# Altium project Motor_ctrl.PrjPcb
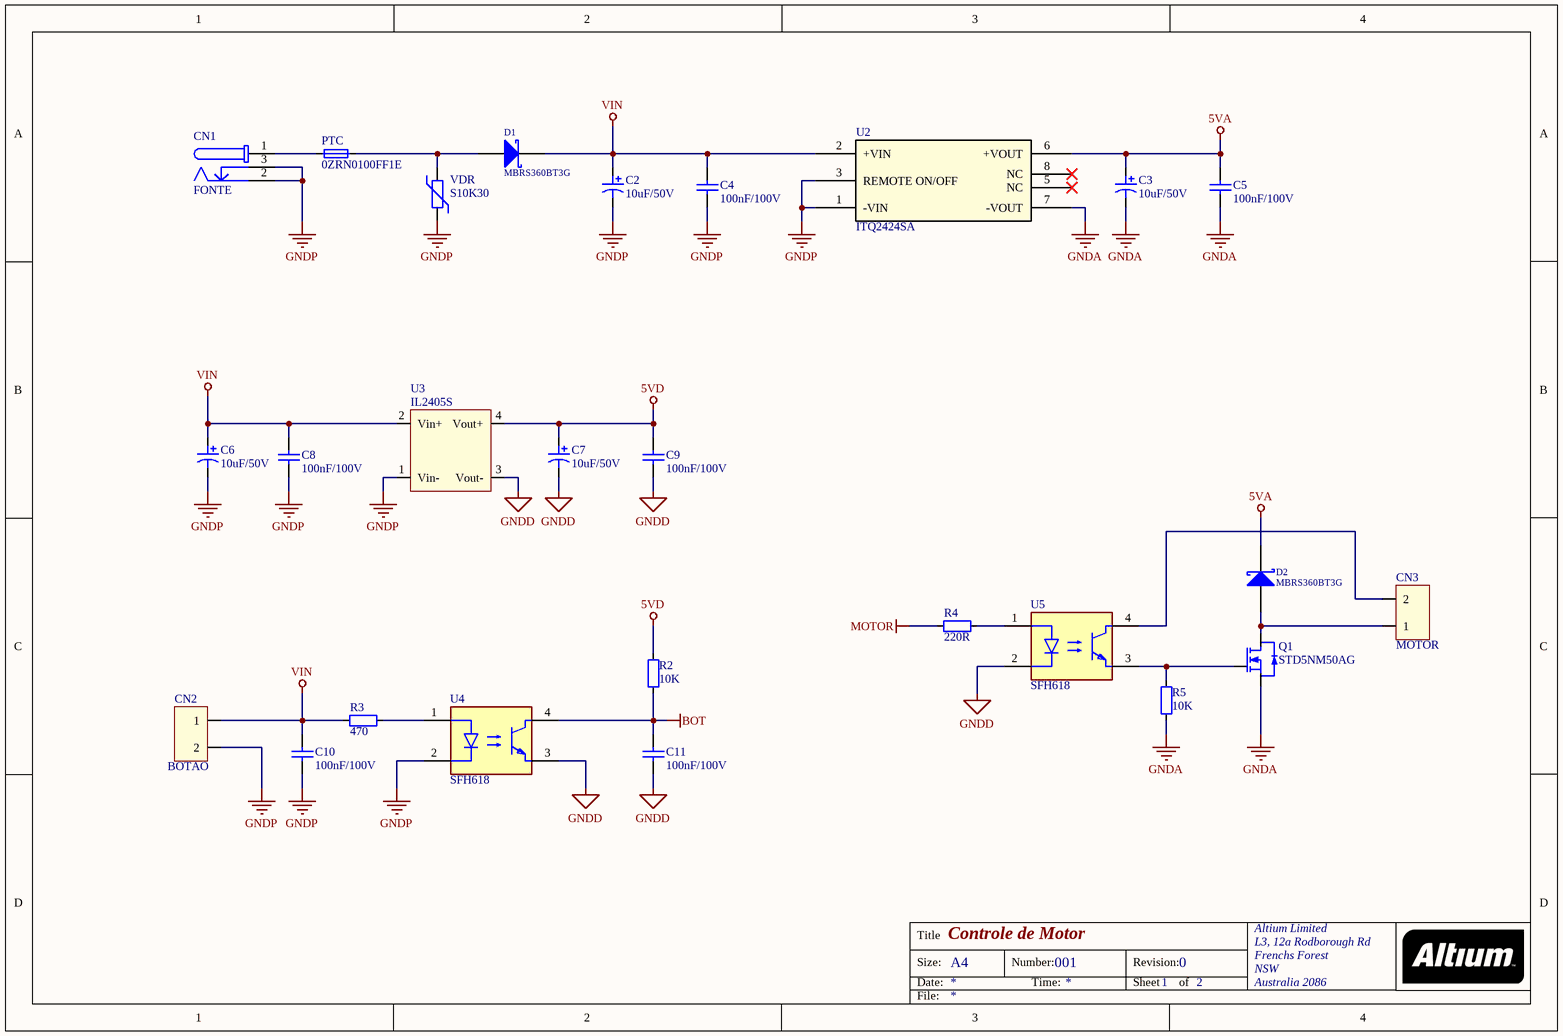
[diagram p0: Sheet1.SchDoc]
2 sheets, 42 parts. Net scope: global (net labels, ports and power ports of the same name join across sheets).
Board file: PCB1.PcbDoc
Sheets:
  Sheet1.SchDoc
  Sheet2.SchDoc

## Sheet Sheet1.SchDoc: Controle de Motor
size A4; Organization: Altium Limited; Address1: L3, 12a Rodborough Rd; Address2: Frenchs Forest; Address3: NSW; Address4: Australia 2086; DocumentNumber: 001; Revision: 0; SheetNumber: 1; SheetTotal: 2

### Parts
C2  10uF/50V  [CapE SMD D6.3 L5.8]
C3  10uF/50V  [CapE SMD D6.3 L5.8]
C4  100nF/100V  [0603C-GENERIC]
C5  100nF/100V  [0603C-GENERIC]
C6  10uF/50V  [CapE SMD D6.3 L5.8]
C7  10uF/50V  [CapE SMD D6.3 L5.8]
C8  100nF/100V  [0603C-GENERIC]
C9  100nF/100V  [0603C-GENERIC]
C10  100nF/100V  [0603C-GENERIC]
C11  100nF/100V  [0603C-GENERIC]
CN1  FONTE  [Power Jack 694106301002]
CN2  BORNE  [AKZ700/2]  (value not drawn)
CN3  BORNE  [AKZ700/2]  (value not drawn)
D1  MBRS360BT3G  [DO-214AA(SMB)]
D2  MBRS360BT3G  [DO-214AA(SMB)]
PTC  0ZRN0100FF1E  [PTC LVR]
Q1  STD5NM50AG  [DPAK-3_ONS]
R2  10K  [0603R]
R3  470  [Res 1206]
R4  220R  [0603R]
R5  10K  [0603R]
U2  ITQ2424SA  [SIP8_ITQ2424_XPR]
U3  IL2405S  [IL SERIES]
U4  SFH618  [FP-83911-MFG]
U5  SFH618  [FP-83911-MFG]
VDR  S10K30  [VDR D12H14.5-7.5]

### Nets
5VA: C3.1(+) C5.2 D2.2(K) U2.6(+VOUT)
5VD: C7.1(+) C9.2 R2.1 U3.4(Vout+)
BOT: C11.2 R2.2 U4.4(C)
GNDA: C3.2(-) C5.1 Q1.2(S) R5.2 U2.7(-VOUT)
GNDD: C7.2(-) C9.1 C11.1 U3.3(Vout-) U4.3(E) U5.2(C)
GNDP: C2.2(-) C4.1 C6.2(-) C8.1 C10.1 CN1.2 CN1.3 CN2.2 U2.1(-VIN) U2.3(REMOTE_ON/OFF) U3.1(Vin-) U4.2(C) VDR.1
MOTOR: R4.1
VIN: C2.1(+) C4.2 C6.1(+) C8.2 C10.2 CN2.1 D1.2(K) R3.2 U2.2(+VIN) U3.2(Vin+)
NetCN1_1: CN1.1 PTC.1
NetCN3_1: CN3.1 D2.1(A) Q1.3(D)
NetCN3_2: CN3.2 U5.4(C)
NetD1_1: D1.1(A) PTC.2 VDR.2
NetQ1_1: Q1.1(G) R5.1 U5.3(E)
NetR3_1: R3.1 U4.1(A)
NetR4_2: R4.2 U5.1(A)

Not connected (* = marked no-connect by the designer): U2 5(NC)* 8(NC)*

### Notes on the sheet
- (near CN3) MOTOR
- (near CN2) BOTAO
- Title
- Size:
- Date:
- A4
- Number:
- Time:
- Revision:
- Sheet
- of
- File:

### Library data of the parts
C2 C3 C6 C7 = Cap Eletrolitico: Capacitor Eletrolítico Radial SMD; Protheus: E3CS3010U0003
C4 C5 C8-C11 = Cap Ceramico SMD: Capacitor Cerâmico SMD; Protheus: E3CSC100N0002
CN1 = DC Power Jack: Part Number: 694106301002; NexarPartId: 52676100; Voltage Rating: 24V; Insulation Resistance: 100MΩ; Current Rating: 5A; Shielding: Unshielded; Number of Contacts: 3; Mouser: 710-694106301002; Housing Material: Polyamide; Contact Gender: Female; Connector Type: Power; REACH SVHC: Unknown; Termination: Through Hole; Height: 11mm; RoHS: Compliant; Mount: Through Hole; Flammability Rating: UL94 V-0; Packaging: Bulk; Min Operating Temperature: -40°C; Contact Plating: Tin; Max Operating Temperature: 85°C; Operating Supply Voltage: 24V; Contact Material: Gold, Tin
CN2 CN3 = 1x2 Pinos: 2 pinos
D1 D2 = BAT54: Schottky Barrier Diode; Manufacturer 1: Fairchild Semiconductor; Protheus: E2DIOD0000018; Montar: Sim; Supplier Part Number 1: BAT54FSCT-ND; Manufacturer Part Number 1: BAT54
PTC = LVR008N: Fusível Thermistor PTC; Protheus: E2DIVE0000059
Q1 = BSS138: Transistor N-Channel; Protheus: E2TRAN0000008
R2 R5 = E3RSM010K0001: Resistor Metal Filme; Protheus: E3RSM010K0002; Value: 10K
R3 = E3RSM010K0001: Resistor Metal Filme; Protheus: E3RSM430R0001
R4 = E3RSM010K0001: Resistor Metal Filme; Protheus: E3RSM010K0002; Value: 10K
U2 = ITQ2424SA: No Description Available; Manufacturer_Name: XP Power; Copyright: Copyright (C) 2026 Ultra Librarian. All rights reserved.; Manufacturer_Part_Number: ITQ2424SA; RefDes: RefDes; Type: Type
U3 = IL2405S: Conversor DC/DC 2W; Part Number: E2CONV0000006
U4 U5 = CMP-00026-00002-1: Optocoupler Dc-in 1-CH Transistor Dc-out 4-PIN PDIP SMD T/r; Protheus: E2UACO0000007
VDR = VDR 1000L160: Varistor 30VAC/48VDC; Protheus: E2VARI0000001

## Sheet Sheet2.SchDoc: Controle de Motor
size A4; Organization: Altium Limited; Address1: L3, 12a Rodborough Rd; Address2: Frenchs Forest; Address3: NSW; Address4: Australia 2086; DocumentNumber: 001; Revision: 0; SheetNumber: 2; SheetTotal: 2
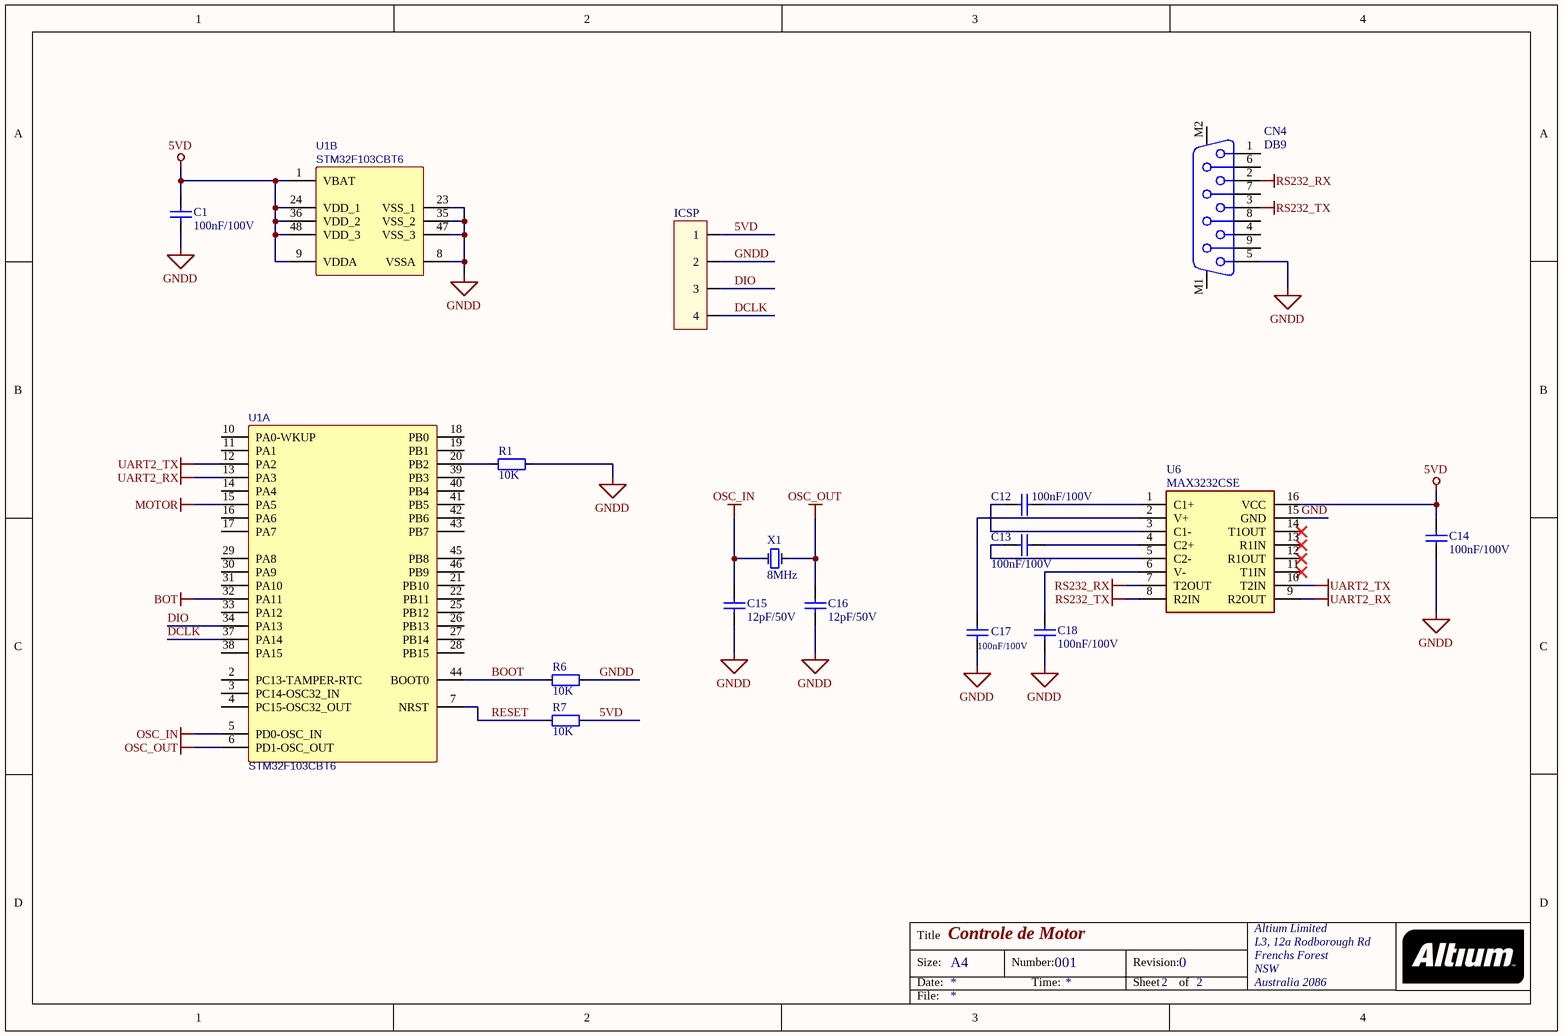
[diagram p1: Sheet2.SchDoc]

### Parts
C1  100nF/100V  [0603C-GENERIC]
C12  100nF/100V  [0603C-GENERIC]
C13  100nF/100V  [0603C-GENERIC]
C14  100nF/100V  [0603C-GENERIC]
C15  12pF/50V  [0603C-GENERIC]
C16  12pF/50V  [0603C-GENERIC]
C17  100nF/100V  [0603C-GENERIC]
C18  100nF/100V  [0603C-GENERIC]
CN4  DB9  [618009231121]
ICSP  Gravação in circuit  [BP 1x4]  (value not drawn)
R1  10K  [0603R]
R6  10K  [0603R]
R7  10K  [0603R]
U1  STM32F103CBT6  [LQFP-48]  (parts A,B of 2)
U6  MAX3232CSE  [SOIC127P600X175-16N]
X1  8MHz  [Cristal HC49S]

### Nets
5VD: C1.2 C14.1 ICSP.1 R7.1 U1.1(VBAT) U1.9(VDDA) U1.24(VDD_1) U1.36(VDD_2) U1.48(VDD_3) U6.16(VCC)
BOT: U1.32(PA11)
GNDD: C1.1 C14.2 C15.1 C16.1 C17.2 C18.2 CN4.5 ICSP.2 R1.2 R6.2 U1.8(VSSA) U1.23(VSS_1) U1.35(VSS_2) U1.47(VSS_3)
MOTOR: U1.15(PA5)
OSC_IN: C15.2 U1.5(PD0-OSC_IN) X1.2(OSC2)
OSC_OUT: C16.2 U1.6(PD1-OSC_OUT) X1.1(OSC1)
RS232_RX: CN4.2 U6.7(T2OUT)
RS232_TX: CN4.3 U6.8(R2IN)
UART2_RX: U1.13(PA3) U6.9(R2OUT)
UART2_TX: U1.12(PA2) U6.10(T2IN)
BOOT: R6.1 U1.44(BOOT0)
DCLK: ICSP.4 U1.37(PA14)
DIO: ICSP.3 U1.34(PA13)
GND: U6.15(GND)
RESET: R7.2 U1.7(NRST)
NetC12_1: C12.1 U6.1(C1+)
NetC12_2: C12.2 U6.3(C1-)
NetC13_1: C13.1 U6.4(C2+)
NetC13_2: C13.2 U6.5(C2-)
NetC17_1: C17.1 U6.2(V+)
NetC18_1: C18.1 U6.6(V-)
NetR1_1: R1.1 U1.20(PB2)

Not connected (* = marked no-connect by the designer): CN4 1 4 6 7 8 9 M1 M2; U1 2(PC13-TAMPER-RTC) 3(PC14-OSC32_IN) 4(PC15-OSC32_OUT) 10(PA0-WKUP) 11(PA1) 14(PA4) 16(PA6) 17(PA7) 18(PB0) 19(PB1) 21(PB10) 22(PB11) 25(PB12) 26(PB13) 27(PB14) 28(PB15) 29(PA8) 30(PA9) 31(PA10) 33(PA12) 38(PA15) 39(PB3) 40(PB4) 41(PB5) 42(PB6) 43(PB7) 45(PB8) 46(PB9); U6 11(T1IN)* 12(R1OUT)* 13(R1IN)* 14(T1OUT)*

### Notes on the sheet
- (near U1) BOOT1
- Title
- Size:
- Date:
- A4
- Number:
- Time:
- Revision:
- Sheet
- of
- File:

### Library data of the parts
C1 C12-C14 C17 C18 = Cap Ceramico SMD: as C4 on sheet Sheet1
C15 C16 = Cap Ceramico SMD: Capacitor Cerâmico; Protheus: E3CSC012P0002; Footprint: cap 1206; Pin Count: 2
CN4 = DB9: Connector DB9
ICSP = BP 1x4 Pinos: Barra de Pinos Macho 4p 11,2mm 180º; Protheus: E5CNM18004003
R1 R6 R7 = E3RSM010K0001: as R2 on sheet Sheet1; Value: 10K
U1 = STM32F103C8T6TR: Protheus: E2UMIC0000012; Value: STM32F103C8T6
U6 = MAX232CSE: Integrated Circuit; Protheus: E2UGER0000019
X1 = Cristal_CM200C: Cristal; Protheus: E2CRST0000004; Value: 8MHz

## Nets that join several sheets
5VD: Sheet1 (C7.1 C9.2 R2.1 U3.4), Sheet2 (10 pins)
BOT: Sheet1 (C11.2 R2.2 U4.4), Sheet2 (U1.32)
GNDD: Sheet1 (6 pins), Sheet2 (14 pins)
MOTOR: Sheet1 (R4.1), Sheet2 (U1.15)